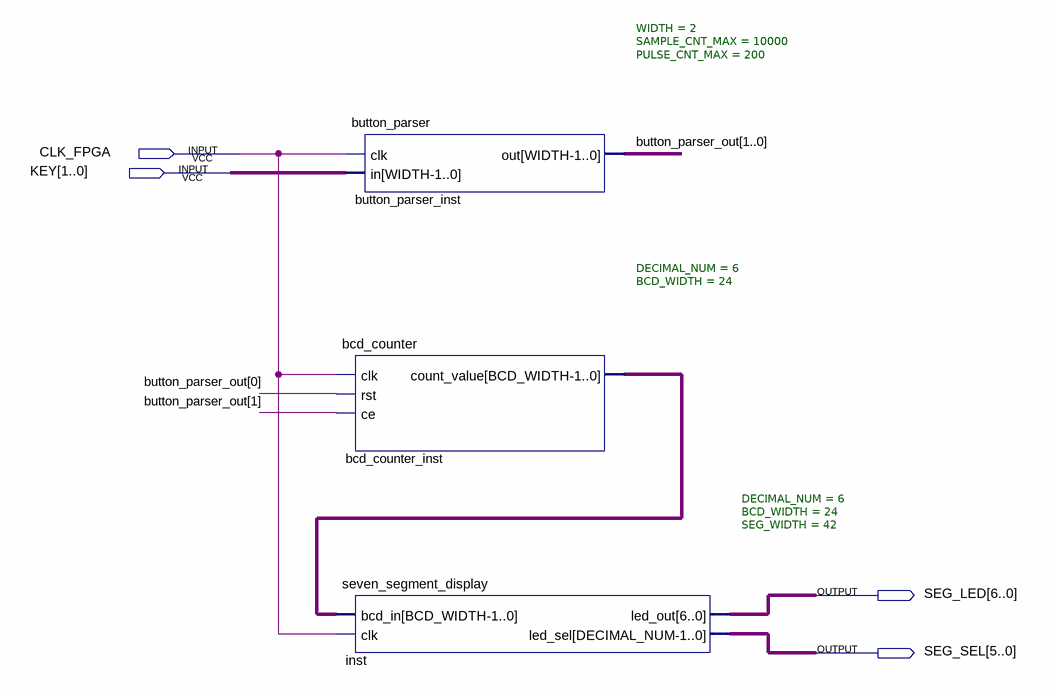
[diagram p0: schematic sheet]
// Quartus schematic top.bdf as structural Verilog: 3 symbols, 4 pins
module top (
  input  CLK_FPGA,
  input  [1:0] KEY,
  output [6:0] SEG_LED,
  output [5:0] SEG_SEL
);

  wire [1:0] button_parser_out;
  wire [23:0] bcd_counter_inst_count_value;

  button_parser #(.WIDTH(2), .SAMPLE_CNT_MAX(10000), .PULSE_CNT_MAX(200)) button_parser_inst (
    .clk(CLK_FPGA), .in(KEY), .out(button_parser_out));
  bcd_counter #(.DECIMAL_NUM(6), .BCD_WIDTH(24)) bcd_counter_inst (
    .clk(CLK_FPGA), .rst(button_parser_out[0]), .ce(button_parser_out[1]),
    .count_value(bcd_counter_inst_count_value));
  seven_segment_display #(.DECIMAL_NUM(6), .BCD_WIDTH(24), .SEG_WIDTH(42)) inst (
    .bcd_in(bcd_counter_inst_count_value), .clk(CLK_FPGA), .led_out(SEG_LED), .led_sel(SEG_SEL));
endmodule
